# EAGLE design in4_single_v0.1 (EAGLE 7.5.0)

## Sheet 1 of 2
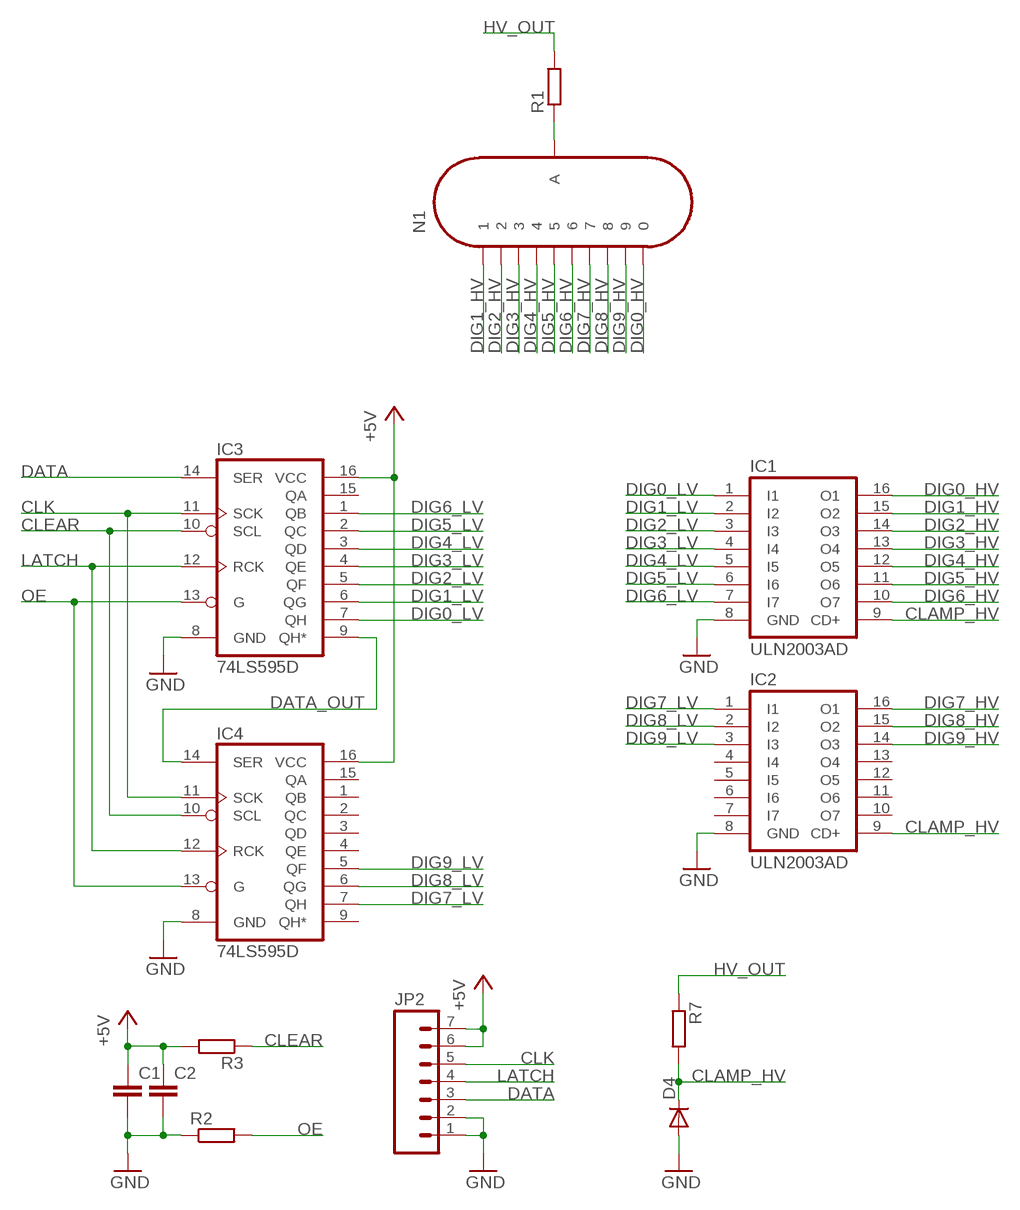
[diagram p0: schematic, sheet 1]

### Parts
C1  C-EUC0805  [C0805]
C2  C-EUC0805  [C0805]
D4  DIODE-SOD-123  [SOD-123]
IC1  ULN2003AD  [SO16]
IC2  ULN2003AD  [SO16]
IC3  74LS595D  [SO16]
IC4  74LS595D  [SO16]
JP2  M07LOCK  [1X07_LOCK]
N1  IN-4  [IN-4]
R1  R-EU_0204/7  [0204/7]
R2  R-EU_R0805  [R0805]
R3  R-EU_R0805  [R0805]
R7  R-EU_R0805  [R0805]

### Nets
+5V: C1.1 C2.1 IC3.16(VCC) IC4.16(VCC) JP2.6 JP2.7 R3.2 ; also sheet 2
CLAMP_HV: D4.C IC1.9(CD+) IC2.9(CD+) R7.2
CLEAR: IC3.10(SCL) IC4.10(SCL) R3.1
CLK: IC3.11(SCK) IC4.11(SCK) JP2.5
DATA: IC3.14(SER) JP2.3
DATA_OUT: IC3.9(QH*) IC4.14(SER)
DIG0_HV: IC1.16(O1) N1.8
DIG0_LV: IC1.1(I1) IC3.7(QH)
DIG1_HV: IC1.15(O2) N1.14
DIG1_LV: IC1.2(I2) IC3.6(QG)
DIG2_HV: IC1.14(O3) N1.9
DIG2_LV: IC1.3(I3) IC3.5(QF)
DIG3_HV: IC1.13(O4) N1.11
DIG3_LV: IC1.4(I4) IC3.4(QE)
DIG4_HV: IC1.12(O5) N1.1
DIG4_LV: IC1.5(I5) IC3.3(QD)
DIG5_HV: IC1.11(O6) N1.12
DIG5_LV: IC1.6(I6) IC3.2(QC)
DIG6_HV: IC1.10(O7) N1.2
DIG6_LV: IC1.7(I7) IC3.1(QB)
DIG7_HV: IC2.16(O1) N1.6
DIG7_LV: IC2.1(I1) IC4.7(QH)
DIG8_HV: IC2.15(O2) N1.3
DIG8_LV: IC2.2(I2) IC4.6(QG)
DIG9_HV: IC2.14(O3) N1.5
DIG9_LV: IC2.3(I3) IC4.5(QF)
GND: C1.2 C2.2 D4.A IC1.8(GND) IC2.8(GND) IC3.8(GND) IC4.8(GND) JP2.1 JP2.2 R2.1 ; also sheet 2
HV_OUT: R1.2 R7.1 ; also sheet 2
LATCH: IC3.12(RCK) IC4.12(RCK) JP2.4
N$11: N1.4(A) R1.1
OE: IC3.13(G) IC4.13(G) R2.2
Unconnected: IC2.4(I4) IC2.5(I5) IC2.6(I6) IC2.7(I7) IC2.10(O7) IC2.11(O6) IC2.12(O5) IC2.13(O4) IC3.15(QA) IC4.1(QB) IC4.2(QC) IC4.3(QD) IC4.4(QE) IC4.9(QH*) IC4.15(QA)

## Sheet 2 of 2
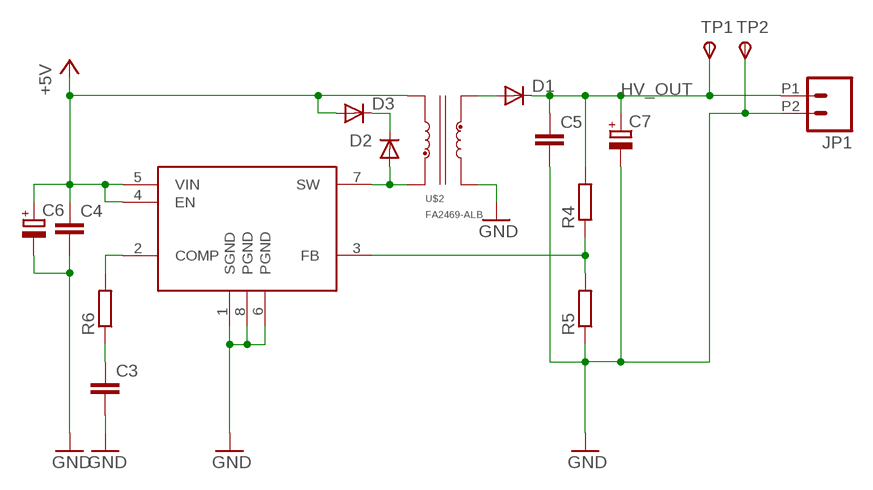
[diagram p1: schematic, sheet 2]

### Parts
C3  C-EUC0805  [C0805]
C4  C-EUC1210  [C1210]
C5  C-EUC1210  [C1210]
C6  CPOL-EUE2.5-5  [E2,5-5]
C7  CPOL-EUE2.5-5  [E2,5-5]
D1  DIODE-DO-214AC  [DO-214AC]
D2  DIODE-SOD-123  [SOD-123]
D3  DIODE-SOD-123  [SOD-123]
IC5  MC3172YM  [SOIC8]
JP1  M022.54MM_SCREWTERM  [1X02_2.54_SCREWTERM]
R4  R-EU_R0805  [R0805]
R5  R-EU_R0805  [R0805]
R6  R-EU_R0805  [R0805]
TP1  TPSPAD1-13  [P1-13]
TP2  TPSPAD1-13  [P1-13]
U$2  FA2469-ALB  [FA2469]

### Nets
+5V: C4.1 C6.+ D3.A IC5.4(EN) IC5.5(VIN) U$2.3 ; also sheet 1
GND: C3.2 C4.2 C5.2 C6.- C7.- IC5.1(SGND) IC5.6(PGND) IC5.8(PGND) JP1.P2 R5.1 TP2.TP(PP) U$2.6 ; also sheet 1
HV_OUT: C5.1 C7.+ D1.1(C) JP1.P1 R4.2 TP1.TP(PP) ; also sheet 1
N$2: D2.C D3.C
N$3: D1.2(A) U$2.4
N$4: IC5.2(COMP) R6.2
N$5: IC5.3(FB) R4.1 R5.2
N$8: C3.1 R6.1
SW: D2.A IC5.7(SW) U$2.1

## Library data of the parts
C1-C5 = rcl:C-EU: CAPACITOR, European symbol
C6 C7 = rcl:CPOL-EU: POLARIZED CAPACITOR, European symbol
D1-D4 = dp_devices:DIODE: Various Diode Packages
IC1 IC2 = uln-udn:ULN2003A: DRIVER ARRAY
IC3 IC4 = SparkFun-DigitalIC:74*595: 8-bit SHIFT REGISTER, output latch; PROD_ID: IC-07875
IC5 = custom_lbr:MC3172YM
JP1 = SparkFun-Connectors:M02: Standard 2-pin 0.1" header. Use with - straight break away headers ( PRT-00116) - right angle break away headers (PRT-00553) - swiss pins (PRT-00743) - machine pins (PRT-00117) - female headers (PRT-00115) Molex polarized connector foot print use with: PRT-08233 with associated crimp pins and housings. 2.54_SCREWTERM for use with PRT-10571. 3.5mm Screw Terminal footprints for PRT-08084 5mm Screw Terminal footprints for use with PRT-08432
JP2 = SparkFun-Connectors:M07: Header 7 Standard 7-pin 0.1" header. Use with straight break away headers (SKU : PRT-00116), right angle break away headers (PRT-00553), swiss pins (PRT-00743), machine pins (PRT-00117), and female headers (PRT-00115). NOTES ON THE VARIANTS LOCK and LOCK_LONGPADS... This footprint was designed to help hold the alignment of a through-hole component (i.e. 7-pin header) while soldering it into place. You may notice that each hole has been shifted either up or down by 0.005 of an inch from it's more standard position (which is usually a perfectly straight line). This slight alteration caused the pins (the squares in the middle) to touch the edges of the holes. Because they are alternating, it causes a "brace" to hold the header in place. 0.005 has proven to be the perfect amount of "off-center" position when using our standard breakaway headers. Although looks a little odd when you look at the bare footprint, once you have a header in there, the alteration is very hard to notice. Also, if you push a header all the way into place, it is covered up entirely on the bottom side. This idea of altering the position of holes to aid alignment will be further integrated into the Sparkfun Library for other footprints. It can help hold any component with 3 or more connection pins.
N1 = russian-nixies:IN-4: IN-4: large numeric topview nixie tube
R1 = resistor:R-EU_: RESISTOR, European symbol
R2-R7 = rcl:R-EU_: RESISTOR, European symbol
TP1 TP2 = testpad:TPS: TEST PIN
U$2 = custom_lbr:FA2469-ALB

## Board
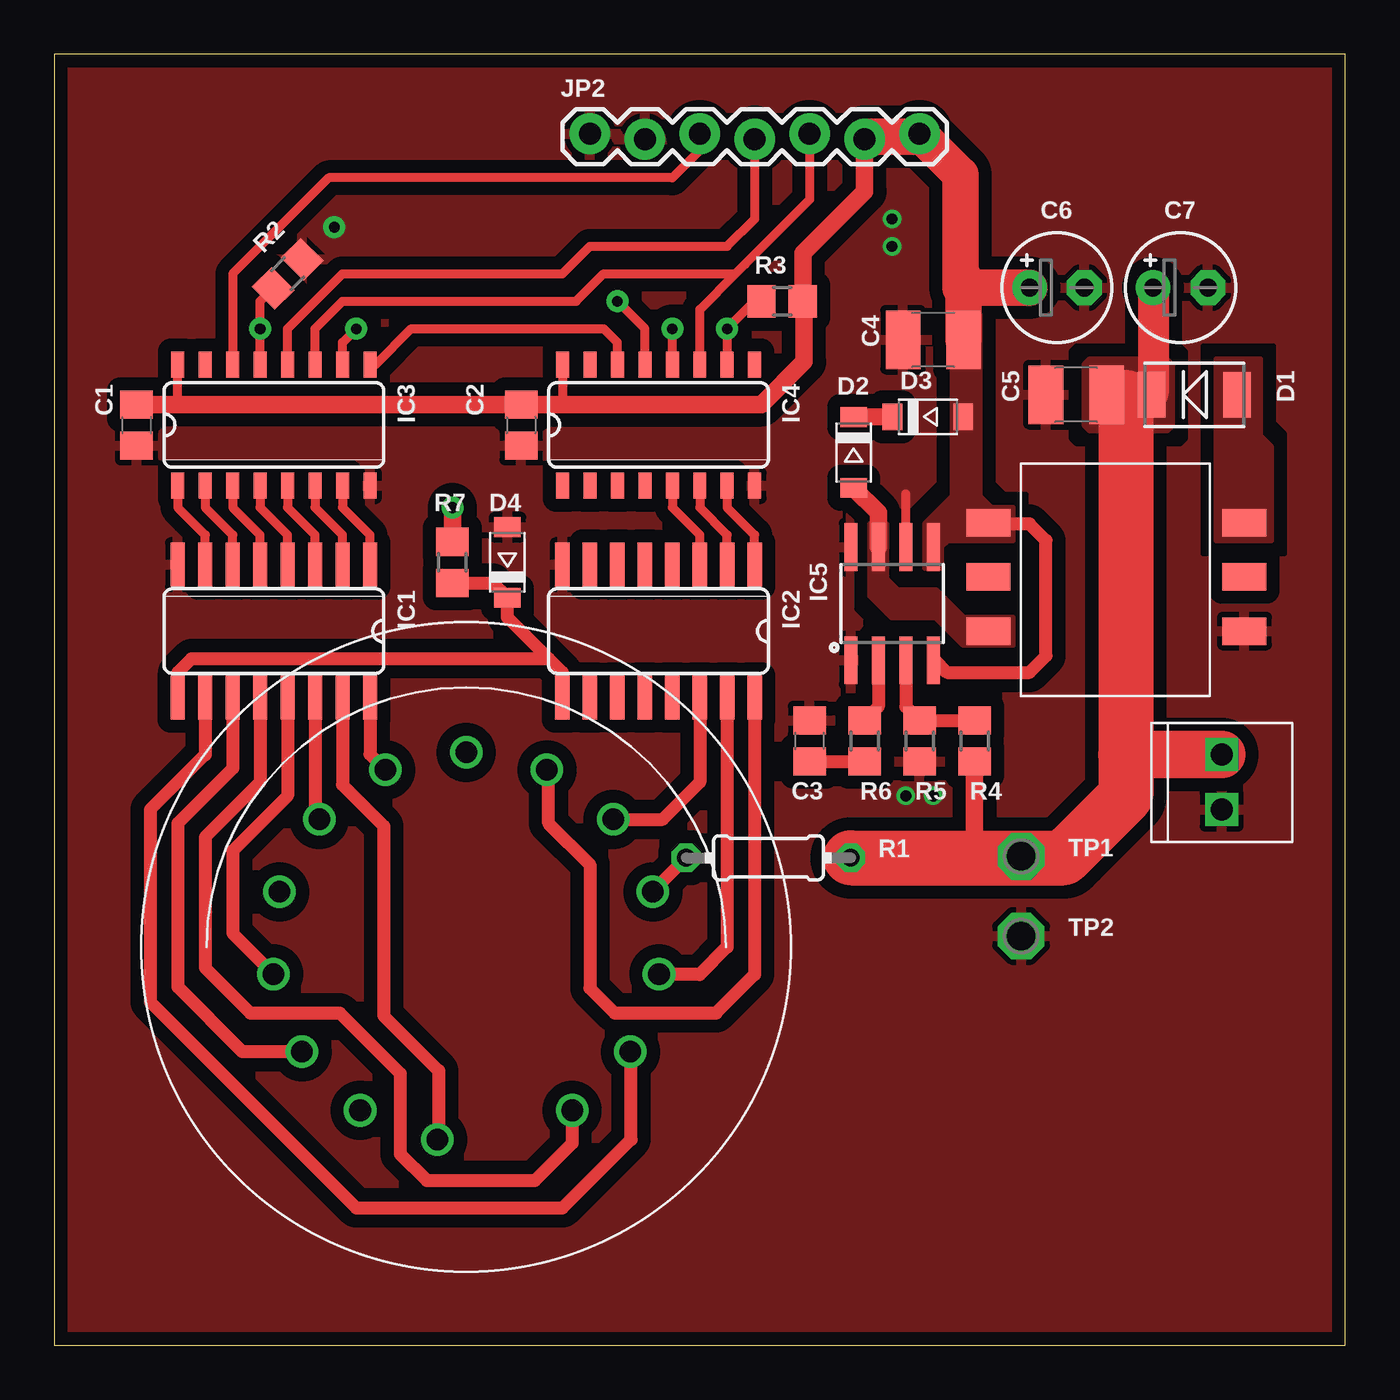
[diagram p2: board, top side]
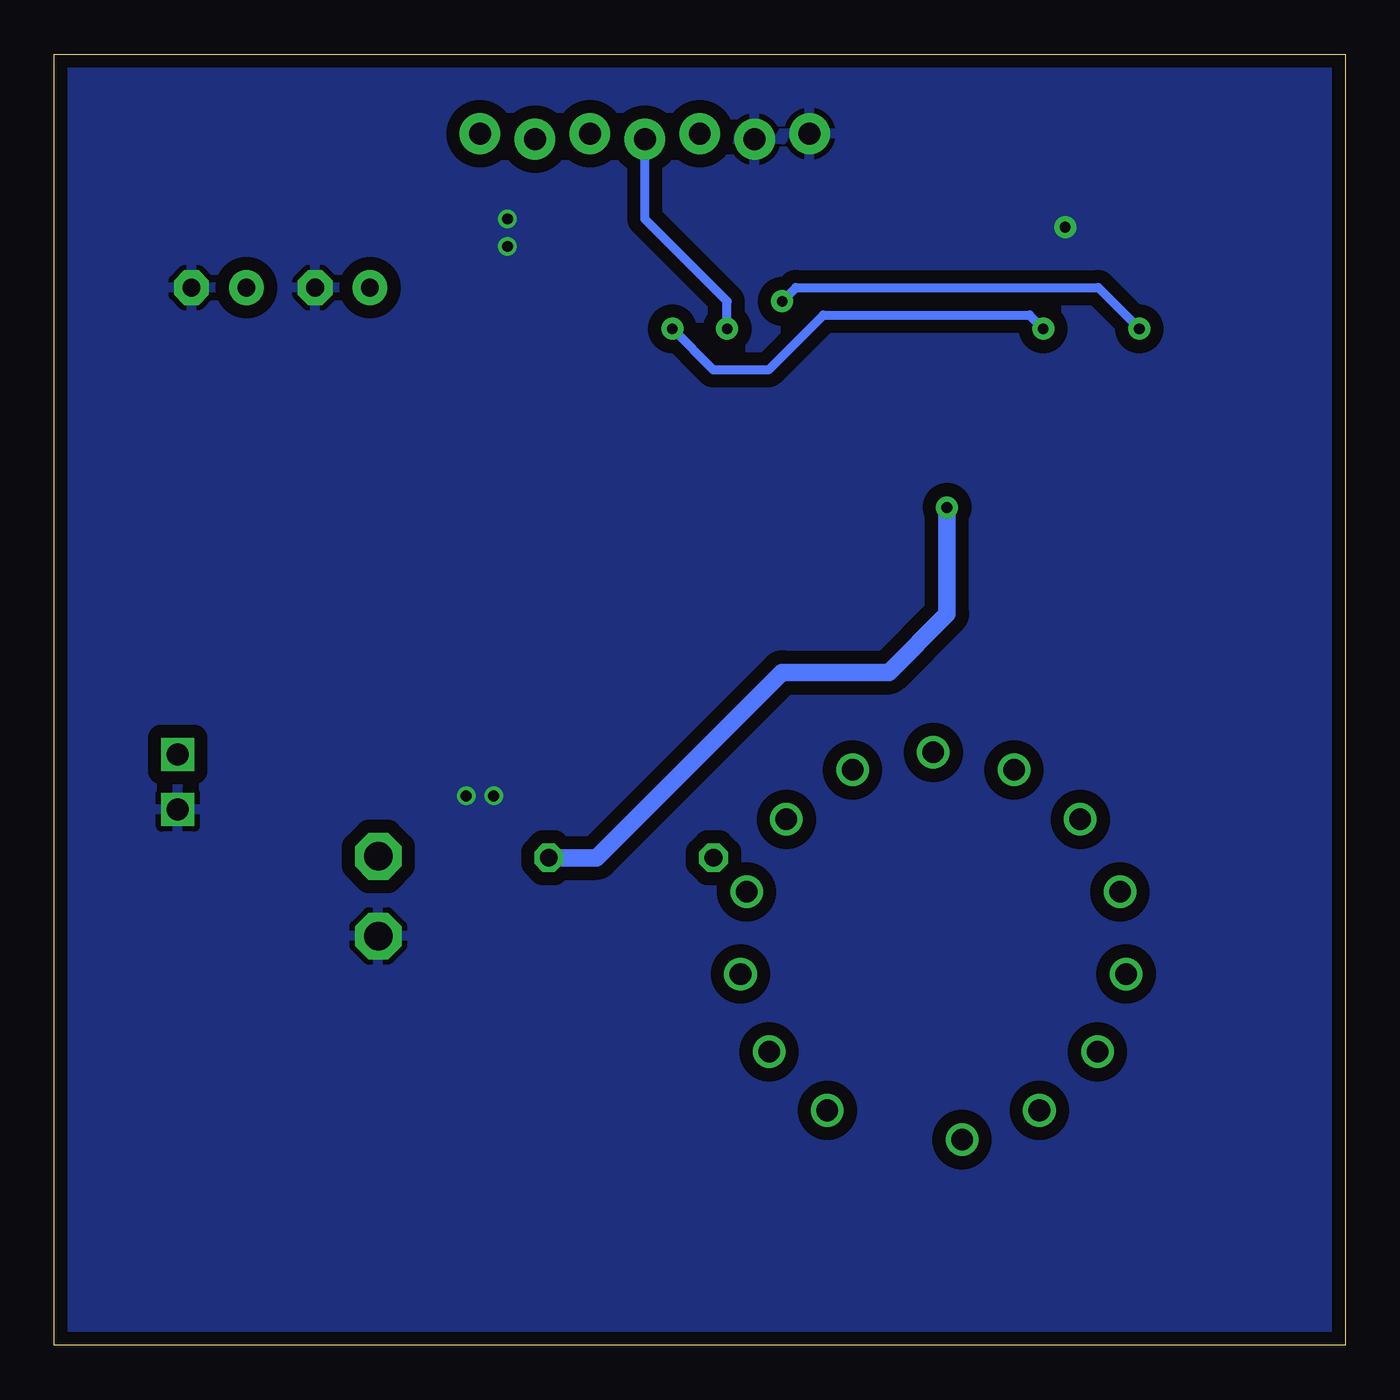
[diagram p3: board, bottom side, seen from below]

Size 59.69 x 59.69 mm. Coordinates in mm from the lower left corner, seen from the top.
Outline: 0,0 59.69,0 59.69,59.69 0,59.69 0,0
Copper layers (1*16): Top 0.0356mm / dielectric 1.5288mm / Bottom 0.0356mm
Design rules "OSHPARK_mod": minimum track width 6mil, minimum drill 13mil, track to track 6mil, track to pad 6mil, pad to pad 6mil, via to via 6mil, smd to smd 6mil, copper to edge 15mil, drill to drill 6mil, minimum pad ring 10mil, minimum via ring 7mil, stop-mask expansion 3mil, vias tented up to drill 20mil, thermal gap 10mil

### Footprints (pad centres in the part's own frame; a part is rotated, then mirrored left to right if it is on the bottom)
C0805 = smd 1.3 x 1.5: 1 -0.95,0; 2 0.95,0
C1210 = smd 1.6 x 2.7: 1 -1.4,0; 2 1.4,0
E2,5-5 = drill 0.813 pad 1.6: + -1.27,0 | drill 0.813 pad 1.6 octagon: - 1.27,0
DO-214AC = smd 1.27 x 2.1: 1 -1.98,0; 2 1.98,0
SOD-123 = smd 0.91 x 1.22: A 1.635,0; C -1.635,0
SO16 = smd 0.66 x 2.032: 1 -4.445,-3.073; 2 -3.175,-3.073; 3 -1.905,-3.073; 4 -0.635,-3.073; 5 0.635,-3.073; 6 1.905,-3.073; 7 3.175,-3.073; 8 4.445,-3.073; 9 4.445,3.073; 10 3.175,3.073; 11 1.905,3.073; 12 0.635,3.073; 13 -0.635,3.073; 14 -1.905,3.073; 15 -3.175,3.073; 16 -4.445,3.073
SO16' = smd 0.6 x 1.2: 1 -4.445,-2.8; 2 -3.175,-2.8; 3 -1.905,-2.8; 4 -0.635,-2.8; 5 0.635,-2.8; 6 1.905,-2.8; 7 3.175,-2.8; 8 4.445,-2.8; 9 4.445,2.8; 10 3.175,2.8; 11 1.905,2.8; 12 0.635,2.8; 13 -0.635,2.8; 14 -1.905,2.8; 15 -3.175,2.8; 16 -4.445,2.8
SOIC8 = smd 0.61 x 2.21: 1 -1.905,-2.616; 2 -0.635,-2.616; 3 0.635,-2.616; 4 1.905,-2.616; 5 1.905,2.616; 6 0.635,2.616; 7 -0.635,2.616; 8 -1.905,2.616
1X02_2.54_SCREWTERM = drill 1.016 square: P1 2.54,0; P2 0,0
1X07_LOCK = drill 1.016 pad 1.88: 1 0,0.127; 2 2.54,-0.127; 3 5.08,0.127; 4 7.62,-0.127; 5 10.16,0.127; 6 12.7,-0.127; 7 15.24,0.127
IN-4 = drill 1: 1 4.902,-7.548; 2 7.59,-4.836; 3 8.912,-1.253; 4 8.629,2.556; 5 6.792,5.904; 6 3.732,8.19; 7 0,9; 8 -3.732,8.19; 9 -6.792,5.904; 10 -8.629,2.556; 11 -8.912,-1.253; 12 -7.59,-4.836; 13 -4.902,-7.548; 14 -1.33,-8.901
0204/7 = drill 0.813 octagon: 1 -3.81,0; 2 3.81,0
R0805 = smd 1.3 x 1.5: 1 -0.95,0; 2 0.95,0
P1-13 = drill 1.321 pad 2.159 octagon: TP 0,0
FA2469 = smd 2.03 x 1.27: 1 0,0; 2 0,2.5; 3 0,5; 4 11.84,5; 5 11.84,2.5; 6 11.84,0

### Placement (x,y rotation side)
C1  3.81,42.55 270 top
C2  21.59,42.55 270 top
C3  34.92,27.94 90 top
C4  40.64,46.48 180 top
C5  47.24,43.94 180 top
C6  46.35,48.9 0 top
C7  52.07,48.9 0 top
D1  52.7,43.94 0 top
D2  36.96,41.27 270 top
D3  40.39,42.93 0 top
D4  20.95,36.2 90 top
IC1  10.16,33.02 180 top
IC2  27.94,33.02 180 top
IC3  74LS595D  [SO16']  10.16,42.55 0 top
IC4  74LS595D  [SO16']  27.94,42.55 0 top
IC5  38.73,34.29 0 top
JP1  53.98,24.77 90 top
JP2  24.77,55.88 0 top
N1  19.05,18.41 0 top
R1  33.02,22.54 0 top
R2  10.79,49.53 225 top
R3  33.66,48.26 0 top
R4  42.55,27.94 270 top
R5  40.01,27.94 90 top
R6  37.47,27.94 90 top
R7  18.41,36.2 270 top
TP1  44.7,22.61 0 top
TP2  44.7,18.92 0 top
U$2  43.18,33.02 0 top

### Tracks (layer width: path | path; a pad name or v marks a point on that pad's centre or on a via)
+5V
  Top 0.406: 5.39,43.49 5.71,43.81 IC3.16 | IC4.16 23.5,43.49
  Top 0.61: U$2.3 43.23,37.97 45.09,37.97 45.85,37.21 45.85,31.88 45.09,31.11 41.27,31.11 40.72,31.67 IC5.4
  Top 0.813: JP2.6 37.47,53.34 34.6,50.48 R3.2 34.67,48.19 34.67,45.47 32.7,43.49 23.5,43.49 C2.1 5.39,43.49 C1.1
  Top 1.676: 41.89,49.53 41.89,48.9 C6.+ | 41.89,49.53 41.89,54.12 JP2.7 40.01,55.88 37.59,55.88 JP2.6 | C4.1 42.04,49.38 41.89,49.53
  pour Top (no thermals): 40.26,35.94 41.02,35.94 41.02,36.93 41.3,37.21 44.32,37.21 44.32,38.73 43.31,38.73 42.8,39.24 42.8,47.62 41.53,47.62 41.53,39.24 40.26,37.97
CLAMP_HV
  Top 0.61: IC1.9 5.71,31.11 6.35,31.75 22.86,31.75 | 22.86,31.75 23.5,31.11 IC2.9 | R7.2 20.27,35.24 D4.C 20.95,33.66 22.86,31.75
CLEAR  (via drill 0.5 pad 1.02)
  Top 0.406: IC3.10 13.34,46.35 v13.97,46.99 | IC4.10 v31.11,46.99 32.38,48.26 R3.1
  Bottom 0.406: v31.11,46.99 29.21,45.09 26.67,45.09 24.13,47.62 14.61,47.62 v13.97,46.99
CLK
  Top 0.406: 31.49,49.53 29.84,47.88 IC4.11 | JP2.5 34.92,52.96 31.94,49.98 31.49,49.53 | IC3.11 12.06,46.99 13.34,48.26 24.13,48.26 25.4,49.53 31.49,49.53
DATA
  Top 0.406: IC3.14 8.26,49.53 12.7,53.98 28.57,53.98 29.84,55.24 JP2.3
DATA_OUT
  Top 0.406: IC4.14 26.04,46.35 25.4,46.99 16.51,46.99 14.87,45.34 IC3.9
DIG0_HV
  Top 0.61: IC1.16 14.61,27.32 N1.8
DIG0_LV
  Top 0.406: IC3.7 13.34,38.73 14.61,37.47 IC1.1
DIG1_HV
  Top 0.61: N1.14 17.78,9.57 17.78,12.7 15.24,15.24 15.24,24 13.34,25.91 IC1.15
DIG1_LV
  Top 0.406: IC3.6 12.06,38.73 13.34,37.47 IC1.2
DIG2_HV
  Top 0.61: IC1.14 12.06,24.51 N1.9
DIG2_LV
  Top 0.406: IC3.5 10.79,38.73 12.06,37.47 IC1.3
DIG3_HV
  Top 0.61: N1.11 8.26,19.05 8.26,22.86 10.79,25.4 IC1.13
DIG3_LV
  Top 0.406: IC3.4 9.53,38.73 10.79,37.47 IC1.4
DIG4_HV
  Top 0.61: N1.1 23.95,9.35 22.23,7.62 17.23,7.62 16,8.84 16,12.57 13.21,15.37 9.07,15.37 6.99,17.45 6.99,23.5 9.53,26.04 IC1.12
DIG4_LV
  Top 0.406: IC3.3 8.26,38.73 9.53,37.47 IC1.5
DIG5_HV
  Top 0.61: N1.12 8.7,13.58 5.71,16.56 5.71,24.13 8.26,26.67 IC1.11
DIG5_LV
  Top 0.406: IC3.2 6.99,38.73 8.26,37.47 IC1.6
DIG6_HV
  Top 0.61: N1.2 26.67,13.55 26.67,9.53 23.5,6.35 13.97,6.35 4.45,15.88 4.45,24.77 6.99,27.3 IC1.10
DIG6_LV
  Top 0.406: IC3.1 5.71,38.73 6.99,37.47 IC1.7
DIG7_HV
  Top 0.61: N1.6 22.86,26.53 22.86,24.13 24.77,22.23 24.77,16.51 25.91,15.37 30.61,15.37 32.38,17.14 IC2.16
DIG7_LV
  Top 0.406: IC4.7 31.11,38.73 32.38,37.47 IC2.1
DIG8_HV
  Top 0.61: IC2.15 31.11,18.41 29.84,17.14 27.98,17.14 N1.3
DIG8_LV
  Top 0.406: IC4.6 29.84,38.73 31.11,37.47 IC2.2
DIG9_HV
  Top 0.61: IC2.14 29.84,26.04 28.13,24.32 N1.5
DIG9_LV
  Top 0.406: IC4.5 28.57,38.73 29.84,37.47 IC2.3
GND  (via drill 0.5, 0.5 pad 1.02)
  Top 0.406: R2.1 12.1,50.2 | IC5.6 39.37,39.37
  other vias: 12.95,51.69 38.73,52.07 38.73,50.8 39.37,25.4 40.64,25.4
  pour Top (isolate 0.61, rank 6): 0,59.69 59.69,59.69 59.69,0 0,0
  pour Bottom (isolate 0.61): 0,59.69 59.69,59.69 59.69,0 0,0
HV_OUT  (via drill 0.5 pad 1.02)
  Top 0.61: 42.61,27.05 R4.2
  Top 0.813: R4.2 42.55,22.54 | v18.41,38.73 R7.1
  Top 1.016: 50.8,44.02 D1.1
  Top 1.27: C5.1 49.4,43.94 49.53,43.81
  Top 1.422: C7.+ 50.8,44.02
  Top 2.184: JP1.P1 49.53,27.3 | TP1.TP 46.74,22.61 46.99,22.86
  Top 2.54: R1.2 42.55,22.54 46.67,22.54 46.99,22.86 49.53,25.4 49.53,27.3 49.53,43.81
  Bottom 0.813: R1.2 34.61,22.54 26.04,31.11 21.11,31.11 18.41,33.81 v18.41,38.73
  pour Top (no thermals): 47.62,45.34 47.62,42.55 47.88,42.29 51.44,42.29 51.69,42.55 51.69,45.31 51.41,45.59 47.88,45.59
LATCH  (via drill 0.5 pad 1.02)
  Top 0.406: IC3.12 10.79,46.99 13.34,49.53 23.5,49.53 24.77,50.8 31.11,50.8 32.38,52.07 JP2.4 | IC4.12 v28.57,46.99
  Bottom 0.406: JP2.4 32.38,52.07 28.57,48.26 v28.57,46.99
N$2
  Top 0.813: D2.C 36.99,42.91 D3.C
N$3
  pour Top (no thermals): 53.72,37.21 56.26,37.21 56.26,41.53 55.75,42.04 55.75,45.59 53.72,45.59
N$4
  Top 0.61: IC5.2 38.1,29.52 R6.2
N$5
  Top 0.61: IC5.3 39.37,29.52 R5.2 R4.1
N$8
  Top 0.61: C3.1 R6.1
N$11
  Top 0.61: N1.4 27.68,21.01 R1.1
OE  (via drill 0.5 pad 1.02)
  Top 0.406: IC3.13 v9.53,46.99 9.53,48.26 R2.2 | IC4.13 27.3,46.99 v26.04,48.26
  Bottom 0.406: v26.04,48.26 25.4,48.9 11.43,48.9 v9.53,46.99
SW
  Top 0.813: IC5.7 38.1,38.5 D2.A
  pour Top (no thermals): 37.72,37.97 37.72,34.67 38.73,33.66 40.77,33.66 42.04,32.38 44.32,32.38 44.32,33.66 42.04,33.66 40.77,34.92 38.99,34.92 38.48,35.43 38.48,37.97